# Altium project Carte_mouvement.PrjPcb
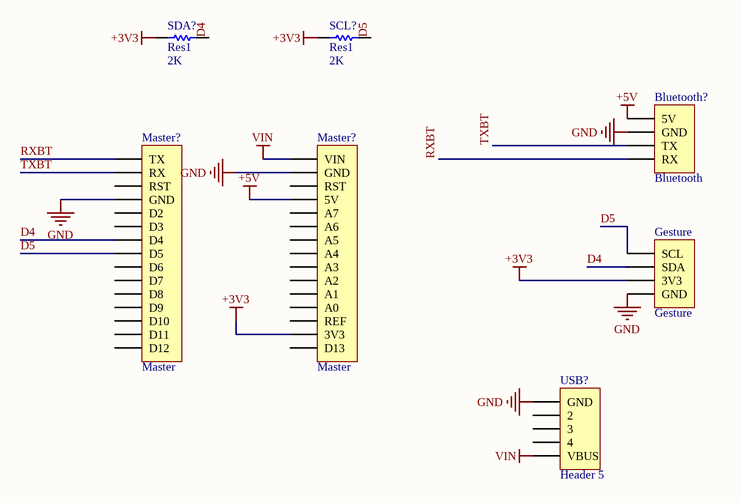
[diagram p0: shematic_carte_mouv.SchDoc]
1 sheet, 7 parts. Net scope: global (net labels, ports and power ports of the same name join across sheets).
Board file: PCB2_mouv_version_2.PcbDoc

## Sheet shematic_carte_mouv.SchDoc
size A4

### Parts
(Parts that share a designator on the sheet are numbered #1, #2 ... from top to bottom, then left to right.)
Bluetooth?  Bluetooth  [HDR1X4]
Gesture  Gesture  [HDR1X4]
Master?#1  Master  [HDR1X15]
Master?#2  Master  [HDR1X15]
SCL?  Res1  value 2K  [AXIAL-0.3]
SDA?  Res1  value 2K  [AXIAL-0.3]
USB?  Header 5  [HDR1X5]

### Nets
+3V3: Gesture.3(3V3) Master?#2.14(3V3) SCL?.1 SDA?.1
+5V: Bluetooth?.1(5V) Master?#2.4(5V)
GND: Bluetooth?.2(GND) Gesture.4(GND) Master?#1.4(GND) Master?#2.2(GND) USB?.1(GND)
VIN: Master?#2.1(VIN) USB?.5(VBUS)
D4: Gesture.2(SDA) Master?#1.7(D4) SDA?.2
D5: Gesture.1(SCL) Master?#1.8(D5) SCL?.2
RXBT: Bluetooth?.4(RX) Master?#1.1(TX)
TXBT: Bluetooth?.3(TX) Master?#1.2(RX)

Not connected (* = marked no-connect by the designer): Master?#1 3(RST) 5(D2) 6(D3) 9(D6) 10(D7) 11(D8) 12(D9) 13(D10) 14(D11) 15(D12); Master?#2 3(RST) 5(A7) 6(A6) 7(A5) 8(A4) 9(A3) 10(A2) 11(A1) 12(A0) 13(REF) 15(D13); USB? 2 3 4

### Library data of the parts
Bluetooth? Gesture = Header 4: Header, 4-Pin; LatestRevisionDate: 17-Jul-2002; LatestRevisionNote: Re-released for DXP Platform.; Publisher: Altium Limited
Master?#1 Master?#2 = Header 15: Header, 15-Pin; LatestRevisionDate: 17-Jul-2002; LatestRevisionNote: Re-released for DXP Platform.; Publisher: Altium Limited
SCL? SDA? = Res1: Resistor; Published: 8-Jun-2000; LatestRevisionDate: 17-Jul-2002; LatestRevisionNote: Re-released for DXP Platform.; PackageReference: AXIAL-0.3; Publisher: Altium Limited; PackageDescription: Axial Device, Thru-Hole; 2 Leads; 0.3 in Pin Spacing
USB? = Header 5: Header, 5-Pin; LatestRevisionDate: 17-Jul-2002; LatestRevisionNote: Re-released for DXP Platform.; Publisher: Altium Limited